# Altium project LINing_PCB.PrjPcb
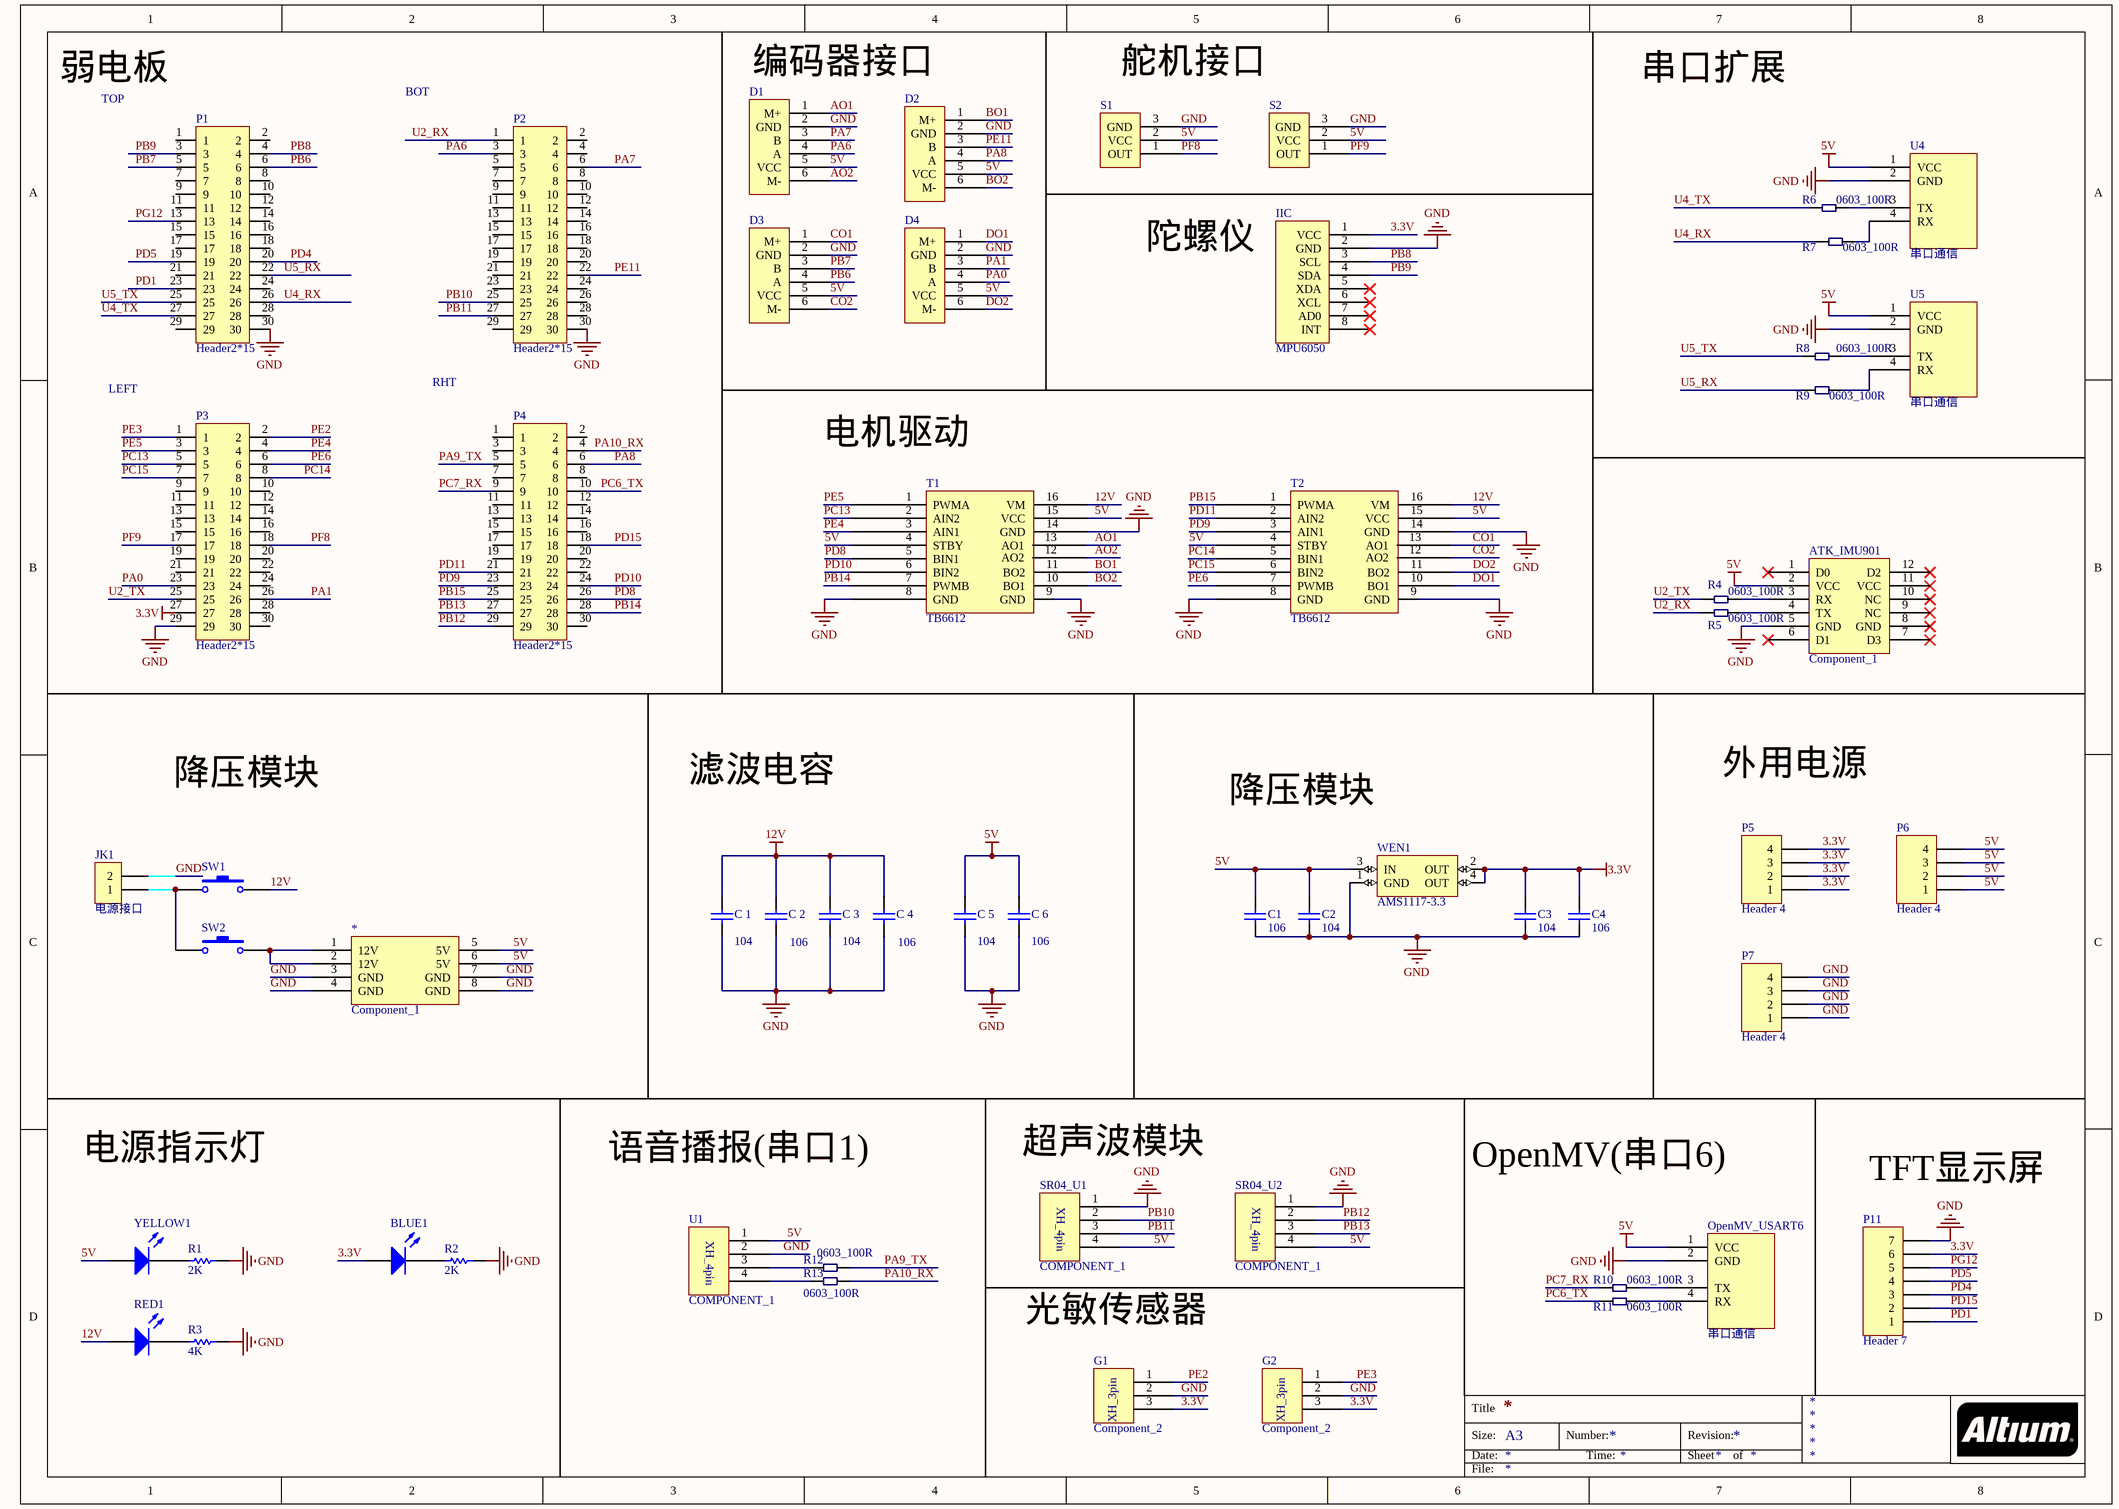
[diagram p0: Sheet_byLIN.SchDoc]
1 sheet, 57 parts. Net scope: global (net labels, ports and power ports of the same name join across sheets).
Board files: PCB_byLin.PcbDoc, PCB_byLINv3.0.PcbDoc, PCB_byLINv4.0.PcbDoc, PCB_byLIN5.0.PcbDoc

## Sheet Sheet_byLIN.SchDoc
size A3

### Parts
*  Component_1  [12-5V电源模块]
ATK_IMU901  Component_1  [PCBComponent_1 - duplicate]
BLUE1  (no value)  [LED 0805G]
C1  106  [C 0603]
C2  104  [C 0603]
C3  104  [C 0603]
C4  106  [C 0603]
C_1  value 104  [C0805]  (hidden comment: Cap)
C_2  value 106  [C0805]  (hidden comment: Cap)
C_3  value 104  [C0805]  (hidden comment: Cap)
C_4  value 106  [C0805]  (hidden comment: Cap)
C_5  value 104  [C0805]  (hidden comment: Cap)
C_6  value 106  [C0805]  (hidden comment: Cap)
D1  (no value)  [XH2.54-WI-6P]
D2  (no value)  [XH2.54-WI-6P]
D3  (no value)  [XH2.54-WI-6P]
D4  (no value)  [XH2.54-WI-6P]
G1  Component_2  [XH2.54-LI-3P]
G2  Component_2  [XH2.54-LI-3P]
IIC  MPU6050  [HDR2.54-M-LI-8P]
JK1  电源接口  [XT-60]
OpenMV_USART6  串口通信  [J-XH-4AW短]
P1  Header2*15  [HDR2X15]
P2  Header2*15  [HDR2X15]
P3  Header2*15  [HDR2X15]
P4  Header2*15  [HDR2X15]
P5  Header 4  [HDR1X4]
P6  Header 4  [HDR1X4]
P7  Header 4  [HDR1X4]
P11  Header 7  [HDR1X7]
R1  2K  [R 0603]
R2  2K  [R 0603]
R3  4K  [R 0603]
R4  0603_100R  [0603_R]
R5  0603_100R  [0603_R]
R6  0603_100R  [0603_R]
R7  0603_100R  [0603_R]
R8  0603_100R  [0603_R]
R9  0603_100R  [0603_R]
R10  0603_100R  [0603_R]
R11  0603_100R  [0603_R]
R12  0603_100R  [0603_R]
R13  0603_100R  [0603_R]
RED1  (no value)  [LED 0805G]
S1  (no value)  [HDR2.54-LI-3P]
S2  (no value)  [HDR2.54-LI-3P]
SR04_U1  COMPONENT_1  [XH2.54-LI-4P]
SR04_U2  COMPONENT_1  [XH2.54-LI-4P]
SW1  (no value)  [10*15mm船型开关]
SW2  (no value)  [10*15mm船型开关]
T1  TB6612  [tb6612fng]
T2  TB6612  [tb6612fng]
U1  COMPONENT_1  [J-XH-4AW短]
U4  串口通信  [J-XH-4AW短]
U5  串口通信  [J-XH-4AW短]
WEN1  AMS1117-3.3  [SOT-223]
YELLOW1  (no value)  [LED 0805G]

### Nets
3.3V: BLUE1.1(A) C3.2 C4.2 G1.3 G2.3 IIC.1(VCC) P3.27 P5.1 P5.2 P5.3 P5.4 P11.6 WEN1.2(OUT) WEN1.4(OUT)
5V: *.5(5V) *.6(5V) ATK_IMU901.2(VCC) C1.2 C2.2 C_5.2 C_6.2 D1.5(VCC) D2.5(VCC) D3.5(VCC) D4.5(VCC) OpenMV_USART6.1(VCC) P6.1 P6.2 P6.3 P6.4 S1.2(VCC) S2.2(VCC) SR04_U1.4 SR04_U2.4 T1.4(STBY) T1.15(VCC) T2.4(STBY) T2.15(VCC) U1.1 U4.1(VCC) U5.1(VCC) WEN1.3(IN) YELLOW1.1(A)
12V: C_1.2 C_2.2 C_3.2 C_4.2 RED1.1(A) SW1.2 T1.16(VM) T2.16(VM)
GND: *.3(GND) *.4(GND) *.7(GND) *.8(GND) ATK_IMU901.5(GND) C1.1 C2.1 C3.1 C4.1 C_1.1 C_2.1 C_3.1 C_4.1 C_5.1 C_6.1 D1.2(GND) D2.2(GND) D3.2(GND) D4.2(GND) G1.2 G2.2 IIC.2(GND) JK1.2 OpenMV_USART6.2(GND) P1.30 P2.30 P3.29 P7.1 P7.2 P7.3 P7.4 P11.7 R1.2 R2.2 R3.2 S1.3(GND) S2.3(GND) SR04_U1.1 SR04_U2.1 T1.8(GND) T1.9(GND) T1.14(GND) T2.8(GND) T2.9(GND) T2.14(GND) U1.2 U4.2(GND) U5.2(GND) WEN1.1(GND)
AO1: D1.1(M+) T1.13(AO1)
AO2: D1.6(M-) T1.12(AO2)
BO1: D2.1(M+) T1.11(BO2)
BO2: D2.6(M-) T1.10(BO1)
CO1: D3.1(M+) T2.13(AO1)
CO2: D3.6(M-) T2.12(AO2)
DO1: D4.1(M+) T2.10(BO1)
DO2: D4.6(M-) T2.11(BO2)
PA0: D4.4(A) P3.23
PA1: D4.3(B) P3.26
PA6: D1.4(A) P2.3
PA7: D1.3(B) P2.6
PA8: D2.4(A) P4.6
PA9_TX: P4.5 R12.2
PA10_RX: P4.4 R13.2
PB6: D3.4(A) P1.6
PB7: D3.3(B) P1.5
PB8: IIC.3(SCL) P1.4
PB9: IIC.4(SDA) P1.3
PB10: P2.25 SR04_U1.2
PB11: P2.27 SR04_U1.3
PB12: P4.29 SR04_U2.2
PB13: P4.27 SR04_U2.3
PB14: P4.28 T1.7(PWMB)
PB15: P4.25 T2.1(PWMA)
PC6_TX: P4.10 R11.1
PC7_RX: P4.9 R10.1
PC13: P3.5 T1.2(AIN2)
PC14: P3.8 T2.5(BIN1)
PC15: P3.7 T2.6(BIN2)
PD1: P1.23 P11.1
PD4: P1.20 P11.3
PD5: P1.19 P11.4
PD8: P4.26 T1.5(BIN1)
PD9: P4.23 T2.3(AIN1)
PD10: P4.24 T1.6(BIN2)
PD11: P4.21 T2.2(AIN2)
PD15: P4.18 P11.2
PE2: G1.1 P3.2
PE3: G2.1 P3.1
PE4: P3.4 T1.3(AIN1)
PE5: P3.3 T1.1(PWMA)
PE6: P3.6 T2.7(PWMB)
PE11: D2.3(B) P2.22
PF8: P3.18 S1.1(OUT)
PF9: P3.17 S2.1(OUT)
PG12: P1.13 P11.5
U2_RX: P2.1 R5.1
U2_TX: P3.25 R4.1
U4_RX: P1.26 R7.1
U4_TX: P1.27 R6.1
U5_RX: P1.22 R9.1
U5_TX: P1.25 R8.1
Net*_1: *.1(12V) *.2(12V) SW2.2
NetATK_IMU901_3: ATK_IMU901.3(RX) R4.2
NetATK_IMU901_4: ATK_IMU901.4(TX) R5.2
NetBLUE1_2: BLUE1.2(K) R2.1
NetJK1_1: JK1.1 SW1.1 SW2.1
NetOpenMV_USART6_3: OpenMV_USART6.3(TX) R10.2
NetOpenMV_USART6_4: OpenMV_USART6.4(RX) R11.2
NetR1_1: R1.1 YELLOW1.2(K)
NetR3_1: R3.1 RED1.2(K)
NetR6_2: R6.2 U4.3(TX)
NetR7_2: R7.2 U4.4(RX)
NetR8_2: R8.2 U5.3(TX)
NetR9_2: R9.2 U5.4(RX)
NetR12_1: R12.1 U1.3
NetR13_1: R13.1 U1.4

Not connected (* = marked no-connect by the designer): ATK_IMU901 1(D0)* 6(D1)* 7(D3)* 8(GND)* 9(NC)* 10(NC)* 11(VCC)* 12(D2)*; IIC 5(XDA)* 6(XCL)* 7(AD0)* 8(INT)*; P1 1 2 7 8 9 10 11 12 14 15 16 17 18 21 24 28 29; P2 2 4 5 7 8 9 10 11 12 13 14 15 16 17 18 19 20 21 23 24 26 28 29; P3 9 10 11 12 13 14 15 16 19 20 21 22 24 28 30; P4 1 2 3 7 8 11 12 13 14 15 16 17 19 20 22 30

### Notes on the sheet
- (near P1) 弱电板
- TOP
- BOT
- 编码器接口
- 舵机接口
- 串口扩展
- (near IIC) 陀螺仪
- LEFT
- RHT
- (near T1) 电机驱动
- 外用电源
- 降压模块
- 滤波电容
- 电源指示灯
- 语音播报(串口1)
- 超声波模块
- OpenMV(串口6)
- TFT显示屏
- 光敏传感器
- Title
- Size:
- Date:
- A3
- Number:
- Time:
- Revision:
- Sheet
- of
- File:
- (in symbol COMPONENT_1) XH_4pin
- (in symbol Component_2) XH_3pin

### Library data of the parts
* = Component_1: pin to pad: 1>3 2>3 3>4 5>2 6>2 7>1 8>1
BLUE1 RED1 YELLOW1 = LED1: Typical RED GaAs LED; Published: 8-Jun-2000; LatestRevisionDate: 08-Jul-2005; LatestRevisionNote: Mech Layer 1 removed.; PackageReference: LED-1; Publisher: Altium Limited; PackageDescription: LED; 2 Leads
C1-C4 C_1-C_6 = Cap: Capacitor; Published: 8-Jun-2000; LatestRevisionDate: 17-Jul-2002; LatestRevisionNote: Re-released for DXP Platform.; PackageReference: RAD-0.3; Publisher: Altium Limited; PackageDescription: Radial Cap, Thru-Hole; 2 Leads; 0.3 in Pin Spacing
D1-D4 = P1
JK1 = VH2
OpenMV_USART6 U4 U5 = XH2.54插座-4P
P5-P7 = Header 4: Header, 4-Pin; LatestRevisionDate: 17-Jul-2002; LatestRevisionNote: Re-released for DXP Platform.; Publisher: Altium Limited
P11 = Header 7: Header, 7-Pin; LatestRevisionDate: 17-Jul-2002; LatestRevisionNote: Re-released for DXP Platform.; Publisher: Altium Limited
R1-R3 = Res1: Resistor; Published: 8-Jun-2000; LatestRevisionDate: 17-Jul-2002; LatestRevisionNote: Re-released for DXP Platform.; PackageReference: AXIAL-0.3; Publisher: Altium Limited; PackageDescription: Axial Device, Thru-Hole; 2 Leads; 0.3 in Pin Spacing
R4-R13 = RES
S1 S2 = sensor
SW1 SW2 = SW-PB: Switch; Published: 24-Mar-1999; LatestRevisionDate: 17-Jul-2002; LatestRevisionNote: Re-released for DXP Platform.; PackageReference: SPST-2; Publisher: Altium Limited; PackageDescription: Switch; 2 Leads
T1 T2 = Component_1_2
WEN1 = ASM1117-3.3